# EAGLE schematic Esp_sensor (EAGLE 6.1)
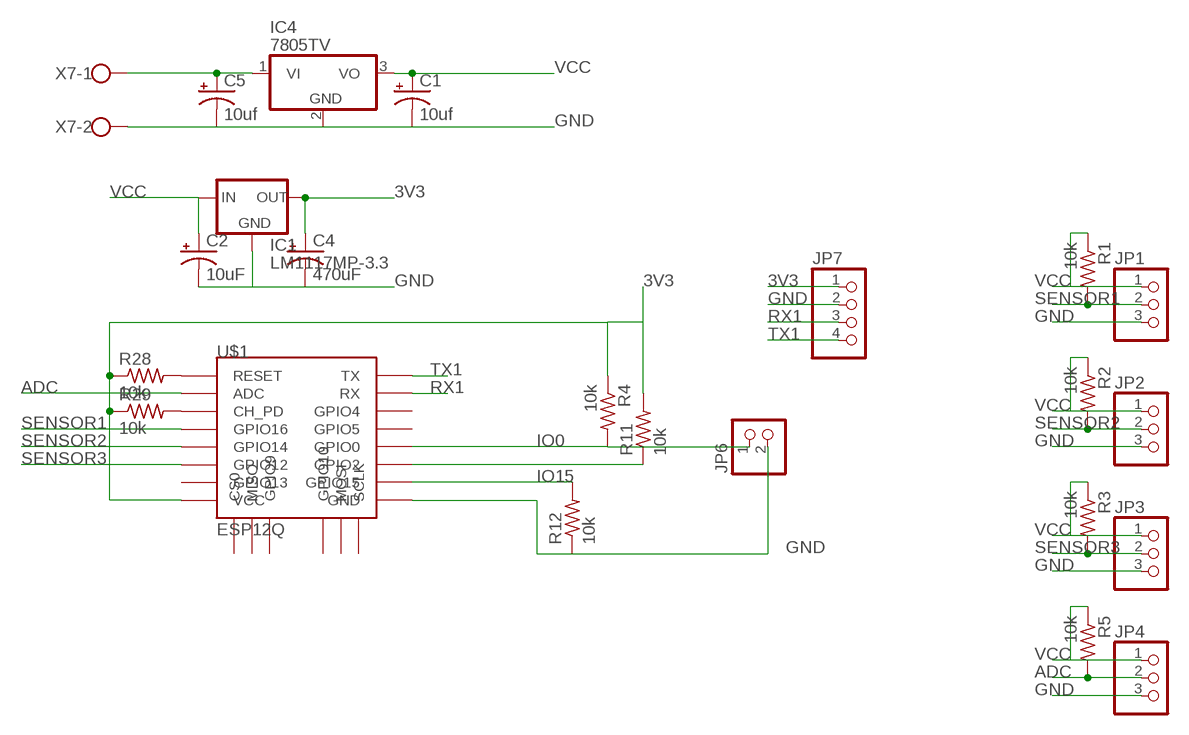
[diagram p0: schematic, sheet 1]

## Parts
C1  10uf  CPOL-USE2.5-6  [E2,5-6]
C2  10uF  CPOL-USE2.5-6  [E2,5-6]
C4  470uF  CPOL-USE5-8.5  [E5-8,5]
C5  10uf  CPOL-USE2.5-6  [E2,5-6]
IC1  LM1117MP-3.3  [SOT223]
IC4  7805TV  [TO220V]
JP1  PINHD-1X3  [1X03]
JP2  PINHD-1X3  [1X03]
JP3  PINHD-1X3  [1X03]
JP4  PINHD-1X3  [1X03]
JP6  PINHD-1X2  [1X02]
JP7  PINHD-1X4  [1X04]
R1  10k  R-US_0207/10  [0207/10]
R2  10k  R-US_0207/10  [0207/10]
R3  10k  R-US_0207/10  [0207/10]
R4  10k  R-US_0207/10  [0207/10]
R5  10k  R-US_0207/10  [0207/10]
R11  10k  R-US_0207/10  [0207/10]
R12  10k  R-US_0207/10  [0207/10]
R28  10k  R-US_0207/10  [0207/10]
R29  10k  R-US_0207/10  [0207/10]
U$1  ESP12Q  [ESP12Q]
X7  W237-102  [W237-102]

## Nets
3V3: C4.+ IC1.2(OUT) IC1.4(OUT) JP7.1 R4.1 R11.2 R28.1 R29.1 U$1.VCC
ADC: JP4.2 R5.2 U$1.ADC
GND: C1.- C2.- C4.- C5.- IC1.1(GND) IC4.2(GND) JP1.3 JP2.3 JP3.3 JP4.3 JP6.2 JP7.2 R12.1 U$1.GND X7.2
IO0: JP6.1 R4.2 U$1.GPIO0
IO15: R12.2 U$1.GPIO15
N$21: R11.1 U$1.GPIO2
N$33: C5.+ IC4.1(VI) X7.1
N$40: R29.2 U$1.CH_PD
N$41: R28.2 U$1.RESET
RX1: JP7.3 U$1.RX
SENSOR1: JP1.2 R1.2 U$1.GPIO16
SENSOR2: JP2.2 R2.2 U$1.GPIO14
SENSOR3: JP3.2 R3.2 U$1.GPIO12
TX1: JP7.4 U$1.TX
VCC: C1.+ C2.+ IC1.3(IN) IC4.3(VO) JP1.1 JP2.1 JP3.1 JP4.1 R1.1 R2.1 R3.1 R5.1
Unconnected: U$1.CS0 U$1.GPIO4 U$1.GPIO5 U$1.GPIO9 U$1.GPIO10 U$1.GPIO13 U$1.MISO U$1.MOSI U$1.SCLK

## Library data of the parts
C1 C2 C4 C5 = rcl:CPOL-US: POLARIZED CAPACITOR, American symbol
IC1 = lm1117_10:LM1117?-*: 800mA Low-Dropout Linear Regulator Source: http://www.ti.com/lit/ds/symlink/lm1117-n.pdf; MF: Texas Instruments; MPN: LM1117MP-3.3; OC_FARNELL: 9778195; OC_NEWARK: 28X3416
IC4 = linear:78*: Positive VOLTAGE REGULATOR Source: http://cache.national.com/ds/LM/LM78L05.pdf http://www.fairchildsemi.com/ds/LM/LM7805.pdf
JP1-JP4 = pinhead:PINHD-1X3: PIN HEADER
JP6 = pinhead:PINHD-1X2: PIN HEADER
JP7 = pinhead:PINHD-1X4: PIN HEADER
R1-R5 R11 R12 R28 R29 = rcl:R-US_: RESISTOR, American symbol
U$1 = esp826612q:ESP12Q: ESP8266 Wifi module 12-Q
X7 = con-wago-500:W237-102: WAGO SCREW CLAMP; MPN: 237-102; OC_FARNELL: unknown; OC_NEWARK: 70K9898